# EAGLE design ATtiny43U_Study_Arduino (EAGLE 7.2.0)
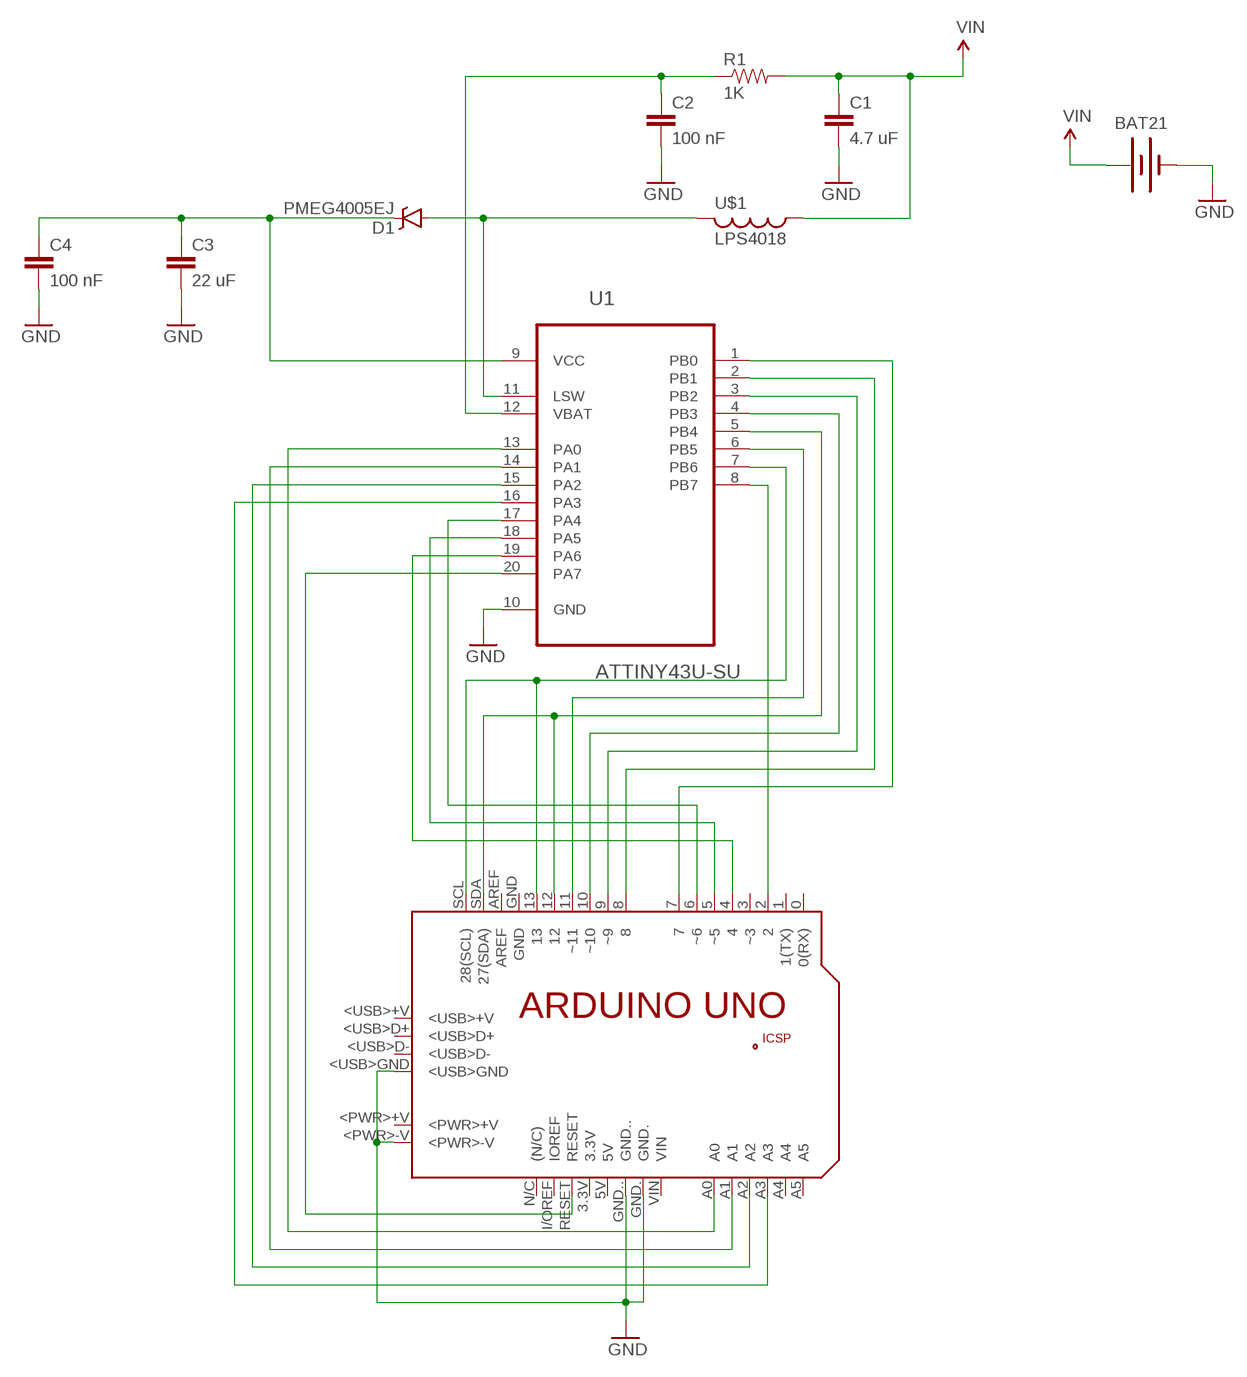
[diagram p0: schematic, sheet 1]

## Parts
BAT21  BATTERYAAA  [BATTERY-AAA]
C1  4.7 uF  CAP0805  [0805]
C2  100 nF  CAP0603-CAP  [0603-CAP]
C3  22 uF  CAP0805  [0805]
C4  100 nF  CAP0603-CAP  [0603-CAP]
D1  PMEG4005EJ  DIODE-SCHOTTKY-PMEG4005EJ  [SOD-323]
PCB1  ARDUINO_UNO  [ARDUINO_UNO]
R1  1K  1KOHM-1/10W-1%(0603)  [0603-RES]
U1  ATTINY43U-SU  [SOIC127P1032X265-20N]
U$1  LPS4018  [LPS4018]

## Nets
GND: BAT21.GND@1(-) C1.2 C2.2 C3.2 C4.2 PCB1.<PWR>-V PCB1.<USB>GND PCB1.GND. PCB1.GND.. U1.10(GND)
LSW: D1.A U1.11(LSW) U$1.P$2
N$1: PCB1.A0 U1.13(PA0)
N$2: PCB1.A1 U1.14(PA1)
N$3: PCB1.A2 U1.15(PA2)
N$4: PCB1.A3 U1.16(PA3)
N$5: PCB1.RESET U1.20(PA7)
N$6: PCB1.12 PCB1.SDA(27(SDA)) U1.5(PB4)
N$7: PCB1.13 PCB1.SCL(28(SCL)) U1.7(PB6)
N$8: PCB1.2 U1.8(PB7)
N$9: PCB1.10(~10) U1.4(PB3)
N$10: PCB1.11(~11) U1.6(PB5)
N$11: PCB1.9(~9) U1.3(PB2)
N$12: PCB1.8 U1.2(PB1)
N$13: PCB1.7 U1.1(PB0)
N$14: PCB1.6(~6) U1.17(PA4)
N$15: PCB1.5(~5) U1.18(PA5)
N$16: PCB1.4 U1.19(PA6)
VBAT: C2.1 R1.1 U1.12(VBAT)
VCC: C3.1 C4.1 D1.C U1.9(VCC)
VIN: BAT21.PWR@1(+) C1.1 R1.2 U$1.P$1
Unconnected: PCB1.0(0(RX)) PCB1.1(1(TX)) PCB1.3(~3) PCB1.<USB>D+ PCB1.<USB>D- PCB1.A4 PCB1.A5 PCB1.AREF PCB1.I/OREF(IOREF) PCB1.MISO PCB1.MOSI PCB1.N/C((N/C)) PCB1.RESET. PCB1.SCK

## Power pins joined to a net without a drawn wire
3.3V: PCB1.3.3V
5V: PCB1.5V
+5V: PCB1.+5V
<PWR>+V: PCB1.<PWR>+V
<USB>+V: PCB1.<USB>+V
GND: PCB1.GND
GND_: PCB1.GND_
VIN: PCB1.VIN

## Library data of the parts
BAT21 = SparkFun-Electromechanical:BATTERY: Battery Holders Various common sizes : AA, AAA, 18650 (PRT-12895), 20mm coin cell and 12mm coin cell. 20MM_4LEGS, BATT-10373; PROD_ID: BATT-08571
C1 = SparkFun-Capacitors:CAP: Capacitor Standard 0603 ceramic capacitor, and 0.1" leaded capacitor.; PARTNO: GRM219R60J475KE19
C2 C4 = SparkFun-Capacitors:CAP: Capacitor Standard 0603 ceramic capacitor, and 0.1" leaded capacitor.
C3 = SparkFun-Capacitors:CAP: Capacitor Standard 0603 ceramic capacitor, and 0.1" leaded capacitor.; PARTNO: GRM21BR60J226ME39
D1 = SparkFun-DiscreteSemi:DIODE-SCHOTTKY: Schottky diodes in SFE's production catalog BAT20J 1A 23V 0.62Vf RB751 120mA 40V 0.37Vf PMEG4005EJ 0.5A 40V 0.42Vf MBRA140 1A 40V 0.5Vf B340A 3A 40V SMA; PARTNO: PMEG2005EJ; PROD_ID: DIO-10955
PCB1 = E14_Arduino_revB:ARDUINO_UNO: Device for representing an Arduino Uno board with a footprint in an EAGLE design. Created by Dave Young for Element14. More EAGLE documentation at: http://www.element14.com/community/community/knode/cadsoft_eagle
R1 = SparkFun-Resistors:1KOHM-1/10W-1%(0603): RES-07856; PROD_ID: RES-07856
U1 = Atmel_By_element14_Batch_1-00:ATTINY43U-SU: 8-bit Microcontroller with In-System Programmable Flash and Boost Converter; MPN: ATTINY43U-SU; OC_FARNELL: 1841623; OC_NEWARK: 12T1338; PACKAGE: SOIC-20; SUPPLIER: Atmel
U$1 = coilcraft:LPS4018; PARTNO: LPS4018-153MRB

## Board
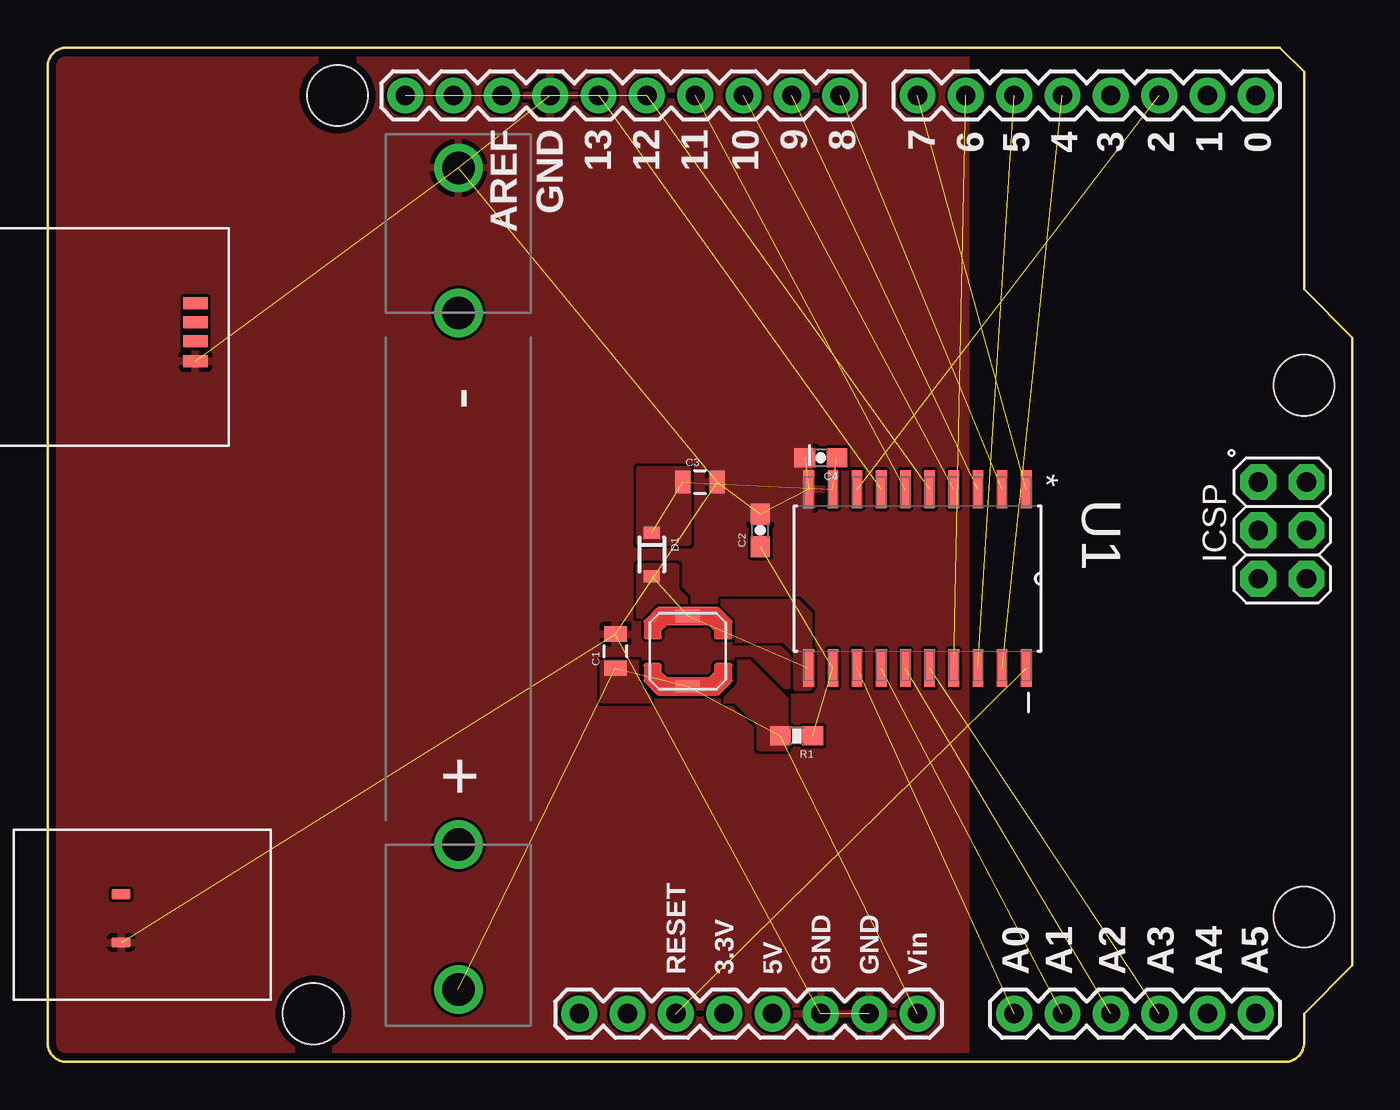
[diagram p1: board, top side]

Size 68.58 x 53.31 mm. Coordinates in mm from the lower left corner, seen from the top.
Copper layers (1*16): Top 0.0356mm / dielectric 1.5011mm / Bottom 0.0356mm
Design rules "default *": minimum track width 6mil, minimum drill 13mil, track to track 6mil, track to pad 6mil, pad to pad 6mil, via to via 6mil, smd to smd 6mil, copper to edge 15mil, drill to drill 6mil, minimum pad ring 7mil, minimum via ring 7mil, stop-mask expansion 3mil, vias tented up to drill 0mil, thermal gap 10mil

### Footprints (pad centres in the part's own frame; a part is rotated, then mirrored left to right if it is on the bottom)
BATTERY-AAA = drill 1.702: GND@1 21.59,0; GND@2 13.97,0; PWR@1 -21.59,0; PWR@2 -13.97,0
0805 = smd 0.8 x 1.2: 1 -0.9,0; 2 0.9,0
0603-CAP = smd 1.1 x 1: 1 -0.85,0; 2 0.85,0
SOD-323 = smd 0.63 x 0.83: A 1.15,0; C -1.15,0
ARDUINO_UNO = drill 1.016 pad 1.88: 0 63.5,50.8; 1 60.96,50.8; 2 58.42,50.8; 3 55.88,50.8; 3.3V 35.56,2.54; 4 53.34,50.8; 5 50.8,50.8; 5V 38.1,2.54; 6 48.26,50.8; 7 45.72,50.8; 8 41.656,50.8; 9 39.116,50.8; 10 36.576,50.8; 11 34.036,50.8; 12 31.496,50.8; 13 28.956,50.8; A0 50.8,2.54; A1 53.34,2.54; A2 55.88,2.54; A3 58.42,2.54; A4 60.96,2.54; A5 63.5,2.54; AREF 23.876,50.8; GND 26.416,50.8; GND. 43.18,2.54; GND.. 40.64,2.54; I/OREF 30.48,2.54; N/C 27.94,2.54; RESET 33.02,2.54; SCL 18.796,50.8; SDA 21.336,50.8; VIN 45.72,2.54 | drill 1.016 pad 1.88 octagon: +5V 66.167,30.48; GND_ 66.167,25.4; MISO 63.627,30.48; MOSI 66.167,27.94; RESET. 63.627,25.4; SCK 63.627,27.94 | smd 1.016 x 0.508: <PWR>+V 3.861,8.814; <PWR>-V 3.861,6.274 | smd 1.27 x 0.635: <USB>+V 7.772,39.878; <USB>D+ 7.772,38.887; <USB>D- 7.772,37.871; <USB>GND 7.772,36.83 | hole 3.2: 66.04,7.62; 66.04,35.56; 15.24,50.8; 13.97,2.54
0603-RES = smd 1.1 x 1: 1 -0.85,0; 2 0.85,0
SOIC127P1032X265-20N = smd 1.981 x 0.559: 1 -4.699,5.715; 2 -4.699,4.445; 3 -4.699,3.175; 4 -4.699,1.905; 5 -4.699,0.635; 6 -4.699,-0.635; 7 -4.699,-1.905; 8 -4.699,-3.175; 9 -4.699,-4.445; 10 -4.699,-5.715; 11 4.699,-5.715; 12 4.699,-4.445; 13 4.699,-3.175; 14 4.699,-1.905; 15 4.699,-0.635; 16 4.699,0.635; 17 4.699,1.905; 18 4.699,3.175; 19 4.699,4.445; 20 4.699,5.715
LPS4018 = smd 0.635 x 1.27: P$1 -1.85,0; P$2 1.85,0

### Placement (x,y rotation side)
BAT21  21.59,25.4 90 top
C1  29.84,21.59 90 top
C2  37.47,27.94 90 top
C3  34.29,30.48 0 top
C4  40.64,31.75 180 top
D1  31.75,26.67 270 top
PCB1  0,0 0 top
R1  39.37,17.14 180 top
U1  45.72,25.4 270 top
U$1  33.66,21.59 90 top

### Tracks (layer width: path | path; a pad name or v marks a point on that pad's centre or on a via)
GND  (10 unrouted)
  pour Top (rank 2): 0,0 48.26,0 48.26,53.34 0,53.34
  pour Top (no thermals): 41.27,28.57 40.01,28.57 40.01,33.02 34.92,33.02 34.92,28.57 38.73,28.57 38.73,26.67 41.27,26.67
LSW  (2 unrouted)
  pour Top (no thermals): 31.11,26.04 33.02,26.04 33.02,24.77 33.66,24.13 39.37,24.13 40.01,23.5 40.01,19.68 39.37,19.68 39.37,21.59 38.73,22.23 31.11,22.23
N$1  (1 unrouted)
N$2  (1 unrouted)
N$3  (1 unrouted)
N$4  (1 unrouted)
N$5  (1 unrouted)
N$6  (2 unrouted)
N$7  (2 unrouted)
N$8  (1 unrouted)
N$9  (1 unrouted)
N$10  (1 unrouted)
N$11  (1 unrouted)
N$12  (1 unrouted)
N$13  (1 unrouted)
N$14  (1 unrouted)
N$15  (1 unrouted)
N$16  (1 unrouted)
VBAT  (2 unrouted)
VCC  (3 unrouted)
  pour Top (isolate 0.254, no thermals): 31.11,27.3 33.66,27.3 33.66,31.11 31.11,31.11
VIN  (4 unrouted)
  pour Top (isolate 0.254, no thermals): 29.21,20.95 29.21,19.05 36.2,19.05 37.47,17.78 37.47,16.51 38.73,16.51 38.73,19.05 36.83,20.95